# Altium project RELAY_BOARD_V1.PrjPcb (part 2 of 2)

## Sheet RELAY17.SchDoc
size A
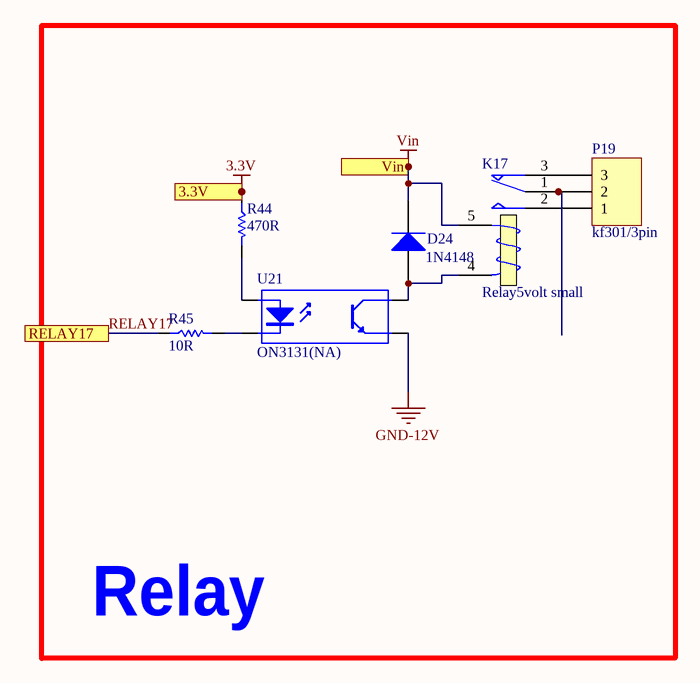
[diagram p21: RELAY17.SchDoc]

### Parts
D24  1N4148  [sod123]
K17  Relay5volt small  [relay5_childern]
P19  kf301/3pin  [Blue Connector 1*3 -kf301]
R44  470R  [0805/resistor]
R45  10R  [0805/resistor]
U21  ON3131(NA)  [OPTO_COUPLER]

### Blocks framed on the sheet
Relay: D24 K17 P19 R44 R45 U21

### Ports
3.3V, RELAY17, Vin

### Nets
3.3V: R44.1 ; port 3.3V
GND-12V: U21.3(E)
Vin: D24.K K17.5 ; port Vin
RELAY17: R45.1 ; port RELAY17
NetD24_A: D24.A K17.4(T2) U21.4(C)
NetK17_1: K17.1(COM) P19.2
NetK17_2: K17.2(NO) P19.1
NetK17_3: K17.3(T1) P19.3
NetR44_2: R44.2 U21.1(A)
NetR45_2: R45.2 U21.2(K)

### Library data of the parts
D24 = Diode 1N4007: 1 Amp General Purpose Rectifier; Published: 8-Jun-2000; LatestRevisionDate: 17-Jul-2002; LatestRevisionNote: Re-released for DXP Platform.; DatasheetVersion: 1998; PackageVersion: Aug-1999; PackageReference: DO-41; Publisher: Altium Limited; PackageDescription: Diode, Axial; Body 5.2 x 2.7 mm (LxDia. max), Lead Dia. 0.86 mm (max); Code_JEDEC: DO-204-AL; ComponentLink1Description: Manufacturer Link; ComponentLink1URL: http://www.fairchildsemi.com/; ComponentLink2Description: Datasheet; ComponentLink2URL: http://www.fairchildsemi.com/ds/1N%2F1N4001.pdf
K17 = Relay: SPDT Relay; Published: 8-Jun-2000; LatestRevisionDate: 17-Jul-2002; LatestRevisionNote: Re-released for DXP Platform.; PackageReference: MODULE5B; Publisher: Altium Limited
P19 = Header 3: LatestRevisionDate: 17-Jul-2002; LatestRevisionNote: Re-released for DXP Platform.; Publisher: Altium Limited
R44 R45 = Resistor: Tolerance: 5%; Power: 1/8 W
  R44: Value: 470R
  R45: Value: 10R
U21 = Optoisolator1: 4-Pin Phototransistor Optocoupler; Published: 24-Mar-1999; LatestRevisionDate: 04-Mar-2005; LatestRevisionNote: Sch pins 3 & 4 Swapped.; DatasheetVersion: Nov-2003; PackageReference: DIP-4; Publisher: Altium Limited

## Sheet RELAY18.SchDoc
size A
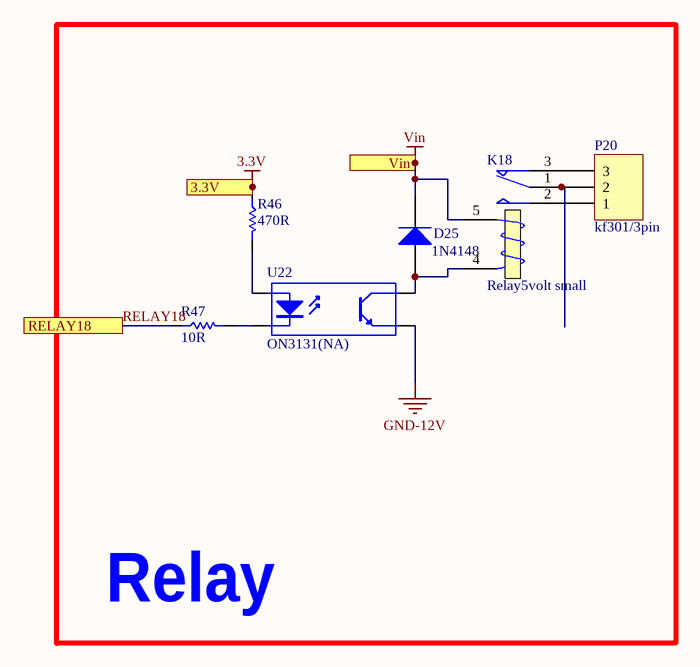
[diagram p22: RELAY18.SchDoc]

### Parts
D25  1N4148  [sod123]
K18  Relay5volt small  [relay5_childern]
P20  kf301/3pin  [Blue Connector 1*3 -kf301]
R46  470R  [0805/resistor]
R47  10R  [0805/resistor]
U22  ON3131(NA)  [OPTO_COUPLER]

### Blocks framed on the sheet
Relay: D25 K18 P20 R46 R47 U22

### Ports
3.3V, RELAY18, Vin

### Nets
3.3V: R46.1 ; port 3.3V
GND-12V: U22.3(E)
Vin: D25.K K18.5 ; port Vin
RELAY18: R47.1 ; port RELAY18
NetD25_A: D25.A K18.4(T2) U22.4(C)
NetK18_1: K18.1(COM) P20.2
NetK18_2: K18.2(NO) P20.1
NetK18_3: K18.3(T1) P20.3
NetR46_2: R46.2 U22.1(A)
NetR47_2: R47.2 U22.2(K)

### Library data of the parts
D25 = Diode 1N4007: 1 Amp General Purpose Rectifier; Published: 8-Jun-2000; LatestRevisionDate: 17-Jul-2002; LatestRevisionNote: Re-released for DXP Platform.; DatasheetVersion: 1998; PackageVersion: Aug-1999; PackageReference: DO-41; Publisher: Altium Limited; PackageDescription: Diode, Axial; Body 5.2 x 2.7 mm (LxDia. max), Lead Dia. 0.86 mm (max); Code_JEDEC: DO-204-AL; ComponentLink1Description: Manufacturer Link; ComponentLink1URL: http://www.fairchildsemi.com/; ComponentLink2Description: Datasheet; ComponentLink2URL: http://www.fairchildsemi.com/ds/1N%2F1N4001.pdf
K18 = Relay: SPDT Relay; Published: 8-Jun-2000; LatestRevisionDate: 17-Jul-2002; LatestRevisionNote: Re-released for DXP Platform.; PackageReference: MODULE5B; Publisher: Altium Limited
P20 = Header 3: LatestRevisionDate: 17-Jul-2002; LatestRevisionNote: Re-released for DXP Platform.; Publisher: Altium Limited
R46 R47 = Resistor: Tolerance: 5%; Power: 1/8 W
  R46: Value: 470R
  R47: Value: 10R
U22 = Optoisolator1: 4-Pin Phototransistor Optocoupler; Published: 24-Mar-1999; LatestRevisionDate: 04-Mar-2005; LatestRevisionNote: Sch pins 3 & 4 Swapped.; DatasheetVersion: Nov-2003; PackageReference: DIP-4; Publisher: Altium Limited

## Sheet RELAY19.SchDoc
size A
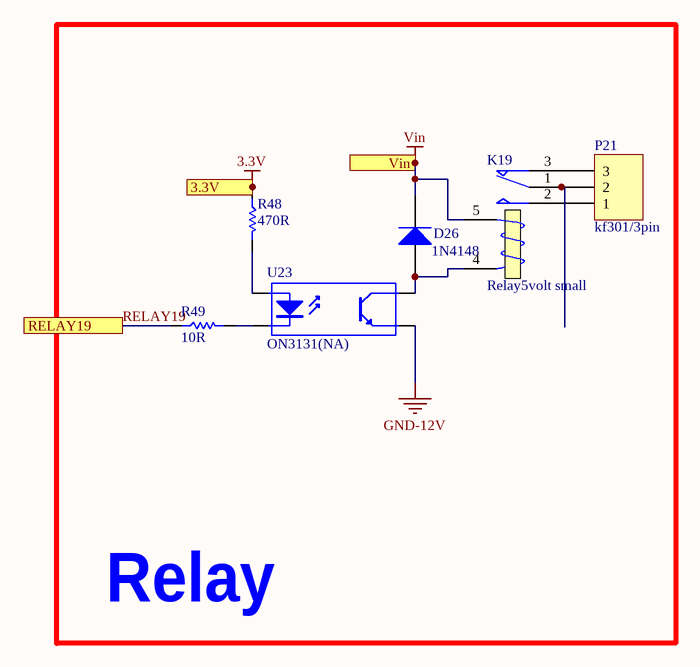
[diagram p23: RELAY19.SchDoc]

### Parts
D26  1N4148  [sod123]
K19  Relay5volt small  [relay5_childern]
P21  kf301/3pin  [Blue Connector 1*3 -kf301]
R48  470R  [0805/resistor]
R49  10R  [0805/resistor]
U23  ON3131(NA)  [OPTO_COUPLER]

### Blocks framed on the sheet
Relay: D26 K19 P21 R48 R49 U23

### Ports
3.3V, RELAY19, Vin

### Nets
3.3V: R48.1 ; port 3.3V
GND-12V: U23.3(E)
Vin: D26.K K19.5 ; port Vin
RELAY19: R49.1 ; port RELAY19
NetD26_A: D26.A K19.4(T2) U23.4(C)
NetK19_1: K19.1(COM) P21.2
NetK19_2: K19.2(NO) P21.1
NetK19_3: K19.3(T1) P21.3
NetR48_2: R48.2 U23.1(A)
NetR49_2: R49.2 U23.2(K)

### Library data of the parts
D26 = Diode 1N4007: 1 Amp General Purpose Rectifier; Published: 8-Jun-2000; LatestRevisionDate: 17-Jul-2002; LatestRevisionNote: Re-released for DXP Platform.; DatasheetVersion: 1998; PackageVersion: Aug-1999; PackageReference: DO-41; Publisher: Altium Limited; PackageDescription: Diode, Axial; Body 5.2 x 2.7 mm (LxDia. max), Lead Dia. 0.86 mm (max); Code_JEDEC: DO-204-AL; ComponentLink1Description: Manufacturer Link; ComponentLink1URL: http://www.fairchildsemi.com/; ComponentLink2Description: Datasheet; ComponentLink2URL: http://www.fairchildsemi.com/ds/1N%2F1N4001.pdf
K19 = Relay: SPDT Relay; Published: 8-Jun-2000; LatestRevisionDate: 17-Jul-2002; LatestRevisionNote: Re-released for DXP Platform.; PackageReference: MODULE5B; Publisher: Altium Limited
P21 = Header 3: LatestRevisionDate: 17-Jul-2002; LatestRevisionNote: Re-released for DXP Platform.; Publisher: Altium Limited
R48 R49 = Resistor: Tolerance: 5%; Power: 1/8 W
  R48: Value: 470R
  R49: Value: 10R
U23 = Optoisolator1: 4-Pin Phototransistor Optocoupler; Published: 24-Mar-1999; LatestRevisionDate: 04-Mar-2005; LatestRevisionNote: Sch pins 3 & 4 Swapped.; DatasheetVersion: Nov-2003; PackageReference: DIP-4; Publisher: Altium Limited

## Sheet RELAY20.SchDoc
size A
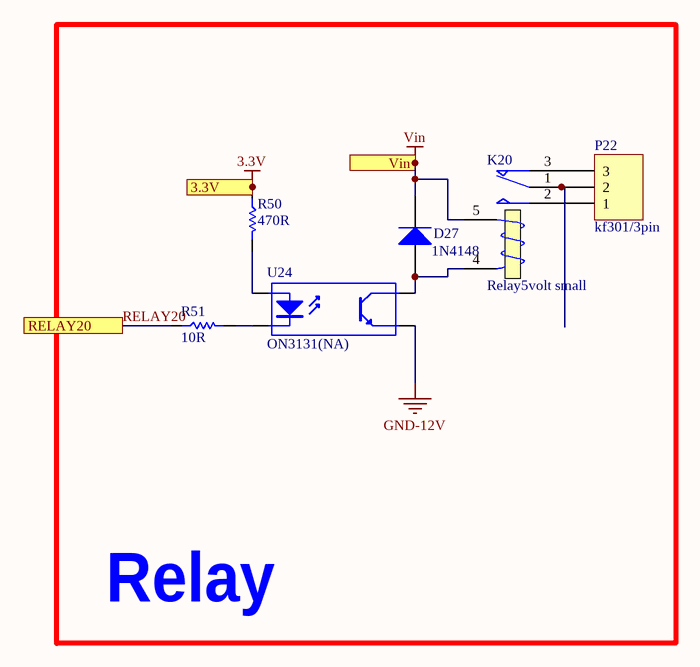
[diagram p24: RELAY20.SchDoc]

### Parts
D27  1N4148  [sod123]
K20  Relay5volt small  [relay5_childern]
P22  kf301/3pin  [Blue Connector 1*3 -kf301]
R50  470R  [0805/resistor]
R51  10R  [0805/resistor]
U24  ON3131(NA)  [OPTO_COUPLER]

### Blocks framed on the sheet
Relay: D27 K20 P22 R50 R51 U24

### Ports
3.3V, RELAY20, Vin

### Nets
3.3V: R50.1 ; port 3.3V
GND-12V: U24.3(E)
Vin: D27.K K20.5 ; port Vin
RELAY20: R51.1 ; port RELAY20
NetD27_A: D27.A K20.4(T2) U24.4(C)
NetK20_1: K20.1(COM) P22.2
NetK20_2: K20.2(NO) P22.1
NetK20_3: K20.3(T1) P22.3
NetR50_2: R50.2 U24.1(A)
NetR51_2: R51.2 U24.2(K)

### Library data of the parts
D27 = Diode 1N4007: 1 Amp General Purpose Rectifier; Published: 8-Jun-2000; LatestRevisionDate: 17-Jul-2002; LatestRevisionNote: Re-released for DXP Platform.; DatasheetVersion: 1998; PackageVersion: Aug-1999; PackageReference: DO-41; Publisher: Altium Limited; PackageDescription: Diode, Axial; Body 5.2 x 2.7 mm (LxDia. max), Lead Dia. 0.86 mm (max); Code_JEDEC: DO-204-AL; ComponentLink1Description: Manufacturer Link; ComponentLink1URL: http://www.fairchildsemi.com/; ComponentLink2Description: Datasheet; ComponentLink2URL: http://www.fairchildsemi.com/ds/1N%2F1N4001.pdf
K20 = Relay: SPDT Relay; Published: 8-Jun-2000; LatestRevisionDate: 17-Jul-2002; LatestRevisionNote: Re-released for DXP Platform.; PackageReference: MODULE5B; Publisher: Altium Limited
P22 = Header 3: LatestRevisionDate: 17-Jul-2002; LatestRevisionNote: Re-released for DXP Platform.; Publisher: Altium Limited
R50 R51 = Resistor: Tolerance: 5%; Power: 1/8 W
  R50: Value: 470R
  R51: Value: 10R
U24 = Optoisolator1: 4-Pin Phototransistor Optocoupler; Published: 24-Mar-1999; LatestRevisionDate: 04-Mar-2005; LatestRevisionNote: Sch pins 3 & 4 Swapped.; DatasheetVersion: Nov-2003; PackageReference: DIP-4; Publisher: Altium Limited

## Nets that join several sheets
3.3V: MCU_G0 (9 pins), ESP12E (5 pins), POWER (C9.1 R4.1 U3.2), RELAY1 (R5.1), RELAY2 (R14.1), RELAY3 (R16.1), RELAY4 (R18.1), RELAY5 (R20.1), RELAY6 (R22.1), RELAY7 (R24.1), RELAY8 (R26.1), RELAY9 (R28.1), RELAY10 (R30.1), RELAY11 (R32.1), RELAY12 (R34.1), RELAY13 (R36.1), RELAY14 (R38.1), RELAY15 (R40.1), RELAY16 (R42.1), RELAY17 (R44.1), RELAY18 (R46.1), RELAY19 (R48.1), RELAY20 (R50.1)
GND: MCU_G0 (6 pins), RECEIVER_DORJI7020 (L3.1 R13.2), ESP12E (C10.1 IC_1.15 P3.2 R9.1), POWER (15 pins)
GND-12V: RELAY2 (U6.3), RELAY3 (U7.3), RELAY4 (U8.3), RELAY5 (U9.3), RELAY6 (U10.3), RELAY7 (U11.3), RELAY8 (U12.3), RELAY9 (U13.3), RELAY10 (U14.3), RELAY11 (U15.3), RELAY12 (U16.3), RELAY13 (U17.3), RELAY14 (U18.3), RELAY15 (U19.3), RELAY16 (U20.3), RELAY17 (U21.3), RELAY18 (U22.3), RELAY19 (U23.3), RELAY20 (U24.3)
Vin: RECEIVER_DORJI7020 (D7.1 D8.1 U5.2 U5.3), POWER (11 pins), RELAY1 (D5.K K1.5), RELAY2 (D9.K K2.5), RELAY3 (D10.K K3.5), RELAY4 (D11.K K4.5), RELAY5 (D12.K K5.5), RELAY6 (D13.K K6.5), RELAY7 (D14.K K7.5), RELAY8 (D15.K K8.5), RELAY9 (D16.K K9.5), RELAY10 (D17.K K10.5), RELAY11 (D18.K K11.5), RELAY12 (D19.K K12.5), RELAY13 (D20.K K13.5), RELAY14 (D21.K K14.5), RELAY15 (D22.K K15.5), RELAY16 (D23.K K16.5), RELAY17 (D24.K K17.5), RELAY18 (D25.K K18.5), RELAY19 (D26.K K19.5), RELAY20 (D27.K K20.5)
RELAY1: MCU_G0 (U1.7), RELAY1 (R6.1)
RELAY2: MCU_G0 (U1.8), RELAY2 (R15.1)
RELAY3: MCU_G0 (U1.11), RELAY3 (R17.1)
RELAY4: MCU_G0 (U1.12), RELAY4 (R19.1)
RELAY5: MCU_G0 (U1.13), RELAY5 (R21.1)
RELAY6: MCU_G0 (U1.14), RELAY6 (R23.1)
RELAY7: MCU_G0 (U1.18), RELAY7 (R25.1)
RELAY8: MCU_G0 (U1.19), RELAY8 (R27.1)
RELAY9: MCU_G0 (U1.21), RELAY9 (R29.1)
RELAY10: MCU_G0 (U1.22), RELAY10 (R31.1)
RELAY11: MCU_G0 (U1.23), RELAY11 (R33.1)
RELAY12: MCU_G0 (U1.24), RELAY12 (R35.1)
RELAY13: MCU_G0 (U1.25), RELAY13 (R37.1)
RELAY14: MCU_G0 (U1.26), RELAY14 (R39.1)
RELAY15: MCU_G0 (U1.27), RELAY15 (R41.1)
RELAY16: MCU_G0 (U1.17), RELAY16 (R43.1)
RELAY17: MCU_G0 (U1.1), RELAY17 (R45.1)
RELAY18: MCU_G0 (U1.32), RELAY18 (R47.1)
RELAY19: MCU_G0 (U1.29), RELAY19 (R49.1)
RELAY20: MCU_G0 (U1.28), RELAY20 (R51.1)
RXD: MCU_G0 (U1.31), ESP12E (IC_1.22)
TXD: MCU_G0 (U1.30), ESP12E (IC_1.21)
UART1_RX_MCU_DRF_TX: MCU_G0 (U1.9), RECEIVER_DORJI7020 (R12.2 R13.1)
UART1_TX_MCU_DRF_RX: MCU_G0 (U1.10), RECEIVER_DORJI7020 (R11.2 U5.4)